# Altium schematic sheet Interface.SchDoc: Relay Tester
size A4 portrait; Date: 2018.12.12; Author: Ivan Perehiniak; Address2: Ivan Perehiniak; Address3: iv.perehinik@gmail.com; Revision: 3; SheetNumber: 3; SheetTotal: 6
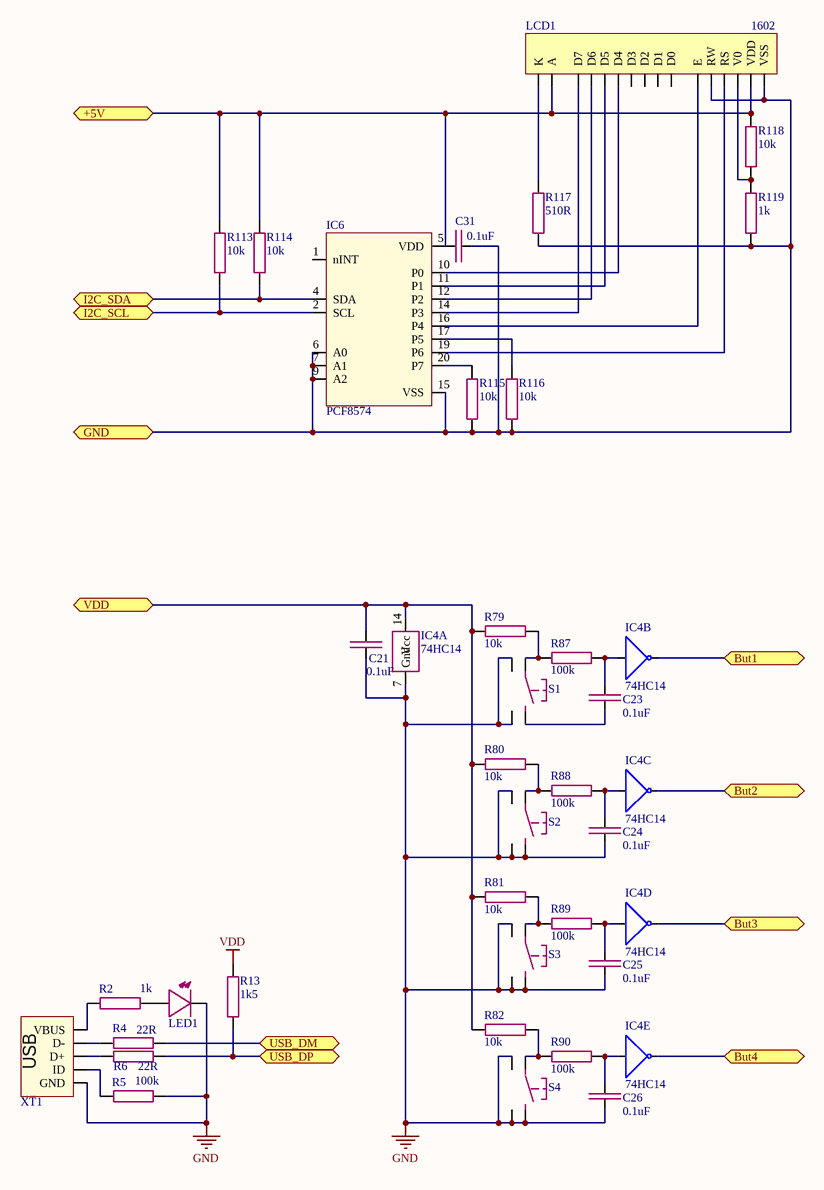
[diagram p0: Interface.SchDoc]

## Parts
C21  0.1uF  [C0603]
C23  0.1uF  [C0603]
C24  0.1uF  [C0603]
C25  0.1uF  [C0603]
C26  0.1uF  [C0603]
C31  0.1uF  [C0603]
IC4  74HC14  [SSOP14]  (parts A,B,C,D,E of 7)
IC6  PCF8574  [SSOP-20N]
LCD1  1602  [Display1602]
LED1  Green LED  [LED0805]  (value not drawn)
R2  1k  [R0603]
R4  22R  [R0603]
R5  100k  [R0603]
R6  22R  [R0603]
R13  1k5  [R0603]
R79  10k  [R0603]
R80  10k  [R0603]
R81  10k  [R0603]
R82  10k  [R0603]
R87  100k  [R0603]
R88  100k  [R0603]
R89  100k  [R0603]
R90  100k  [R0603]
R113  10k  [R0603]
R114  10k  [R0603]
R115  10k  [R0603]
R116  10k  [R0603]
R117  510R  [R0603]
R118  10k  [R0603]
R119  1k  [R0603]
S1  1301.9503  [SW_TACT_HOR]  (value not drawn)
S2  1301.9503  [SW_TACT_HOR]  (value not drawn)
S3  1301.9503  [SW_TACT_HOR]  (value not drawn)
S4  1301.9503  [SW_TACT_HOR]  (value not drawn)
XT1  UX60-MB-5ST  [MiniUSB]  (value not drawn)

## Ports
+5V, But1, But2, But3, But4, GND, I2C_SCL, I2C_SDA, USB_DM, USB_DP, VDD

## Nets
GND: C21.1 C24.1 C25.1 C26.1 IC4.7(Gnd) LED1.2(Cathode) R5.2 S1.1 S1.3 S2.1 S2.3 S2.4 S3.1 S3.3 S3.4 S4.1 S4.3 S4.4 XT1.5(GND)
VDD: R13.2
+5V: C31.2 IC6.5(VDD) LCD1.2(VDD) LCD1.15(A) R113.2 R114.2 R118.2 ; port +5V
But1: IC4.2 ; port But1
But2: IC4.4 ; port But2
But3: IC4.6 ; port But3
But4: IC4.8 ; port But4
GND: C31.1 IC6.6(A0) IC6.7(A1) IC6.9(A2) IC6.15(VSS) LCD1.1(VSS) LCD1.5(RW) R115.1 R116.1 R117.2 R119.1 ; port GND  [a separate net that carries the same name]
I2C_SCL: IC6.2(SCL) R113.1 ; port I2C_SCL
I2C_SDA: IC6.4(SDA) R114.1 ; port I2C_SDA
USB_DM: R4.2 ; port USB_DM
USB_DP: R6.2 R13.1 ; port USB_DP
VDD: C21.2 IC4.14(Vcc) R79.2 R80.2 R81.2 R82.2 ; port VDD  [a separate net that carries the same name]
NetC23_1: C23.1 S1.4
NetC23_2: C23.2 IC4.1 R87.2
NetC24_2: C24.2 IC4.3 R88.2
NetC25_2: C25.2 IC4.5 R89.2
NetC26_2: C26.2 IC4.9 R90.2
NetIC6_10: IC6.10(P0) LCD1.11(D4)
NetIC6_11: IC6.11(P1) LCD1.12(D5)
NetIC6_12: IC6.12(P2) LCD1.13(D6)
NetIC6_14: IC6.14(P3) LCD1.14(D7)
NetIC6_16: IC6.16(P4) LCD1.6(E)
NetIC6_17: IC6.17(P5) R116.2
NetIC6_19: IC6.19(P6) LCD1.4(RS)
NetIC6_20: IC6.20(P7) R115.2
NetLCD1_3: LCD1.3(V0) R118.1 R119.2
NetLCD1_16: LCD1.16(K) R117.1
NetLED1_1: LED1.1(Anode) R2.1
NetR2_2: R2.2 XT1.1(VBUS)
NetR4_1: R4.1 XT1.2(D-)
NetR5_1: R5.1 XT1.4(ID)
NetR6_1: R6.1 XT1.3(D+)
NetR79_1: R79.1 R87.1 S1.2
NetR80_1: R80.1 R88.1 S2.2
NetR81_1: R81.1 R89.1 S3.2
NetR82_1: R82.1 R90.1 S4.2

Not connected (* = marked no-connect by the designer): IC6 1(nINT); LCD1 7(D0) 8(D1) 9(D2) 10(D3)

## Notes on the sheet
- Title
- Size:
- Date:
- A4
- Number:
- Time:
- Revision:
- Sheet
- of
- File:
- (in symbol UX60-MB-5ST) USB

## Library data of the parts
C21 C23-C26 C31 = GMK316F475ZG-T: CAP CER 0.1UF 50V X7R 0603; Category: Capacitors; Manufacturer Part Number: GMK316F475ZG-T; Package / Case: 0603 (1608 Metric); ComponentLink1URL: https://search.kemet.com/component-edge/download/datasheet/C0603C104K5RACTU.pdf; ComponentLink1Description: https://search.kemet.com/component-edge/download/datasheet/C0603C104K5RACTU.pdf
IC4 = MC74HC14ADR2G: IC INVERTER HEX SCHMITT 14SOIC; Category: Integrated Circuits (ICs); Manufacturer Part Number: MC74HC14ADR2G; Package / Case: 14-SOIC (0.154", 3.90mm Width)
IC6 = PCF8574APWR: IC I/O EXPANDER I2C 8B 20TSSOP; Package / Case: 20-TSSOP (0.173", 4.40mm Width); Manufacturer Part Number: PCF8574APWR; Category: Integrated Circuits (ICs)
LCD1 = Display1602: DISP 1602 THT
LED1 = LG R971-KN-1: LED GREEN DIFFUSED 0805 SMD; Category: Optoelectronics; Manufacturer Part Number: LG R971-KN-1; Package / Case: 0805 (2012 Metric)
R2 R119 = ERJ-3GEYJ102V: RES SMD 1K OHM 5% 1/10W 0603; Category: Resistors; Package / Case: 0603 (1608 Metric); Manufacturer Part Number: ERJ-3GEYJ102V; ComponentLink1URL: https://industrial.panasonic.com/cdbs/www-data/pdf/RDA0000/AOA0000C304.pdf; ComponentLink1Description: https://industrial.panasonic.com/cdbs/www-data/pdf/RDA0000/AOA0000C304.pdf; ComponentLink2URL: http://industrial.panasonic.com/www-cgi/jvcr13pz.cgi?E+PZ+3+AOA0005+ERJS03J101V+7+WW; ComponentLink2Description: http://industrial.panasonic.com/www-cgi/jvcr13pz.cgi?E+PZ+3+AOA0005+ERJS03J101V+7+WW; ComponentLink3URL: https://industrial.panasonic.com/cdbs/www-data/pdf/RDO0000/AOA0000C331.pdf; ComponentLink3Description: https://industrial.panasonic.com/cdbs/www-data/pdf/RDO0000/AOA0000C331.pdf
R4 R6 = CRCW060322R0FKEA: RES SMD 22 OHM 1% 1/10W 0603; Category: Resistors; Package / Case: 0603 (1608 Metric); Manufacturer Part Number: CRCW060322R0FKEA
R5 R87-R90 = ERJ-S03J104V: RES SMD 100K OHM 5% 1/10W 0603; Category: Resistors; Package / Case: 0603 (1608 Metric); Manufacturer Part Number: ERJ-S03J104V; ComponentLink1URL: https://industrial.panasonic.com/cdbs/www-data/pdf/RDA0000/AOA0000C304.pdf; ComponentLink1Description: https://industrial.panasonic.com/cdbs/www-data/pdf/RDA0000/AOA0000C304.pdf; ComponentLink2URL: http://industrial.panasonic.com/www-cgi/jvcr13pz.cgi?E+PZ+3+AOA0005+ERJS03J101V+7+WW; ComponentLink2Description: http://industrial.panasonic.com/www-cgi/jvcr13pz.cgi?E+PZ+3+AOA0005+ERJS03J101V+7+WW; ComponentLink3URL: https://industrial.panasonic.com/cdbs/www-data/pdf/RDO0000/AOA0000C331.pdf; ComponentLink3Description: https://industrial.panasonic.com/cdbs/www-data/pdf/RDO0000/AOA0000C331.pdf
R13 = CRCW06031K50JNTABC: RES SMD 1K5 OHM 5% 1/10W 0603; Category: Resistors; Package / Case: 0603 (1608 Metric); Manufacturer Part Number: CRCW06031K50JNTABC
R79-R82 R113-R116 = ERJ-S03J103V: RES SMD 10K OHM 5% 1/10W 0603; Category: Resistors; Package / Case: 0603 (1608 Metric); Manufacturer Part Number: ERJ-S03J103V; ComponentLink1URL: https://industrial.panasonic.com/cdbs/www-data/pdf/RDA0000/AOA0000C304.pdf; ComponentLink1Description: https://industrial.panasonic.com/cdbs/www-data/pdf/RDA0000/AOA0000C304.pdf; ComponentLink2URL: http://industrial.panasonic.com/www-cgi/jvcr13pz.cgi?E+PZ+3+AOA0005+ERJS03J101V+7+WW; ComponentLink2Description: http://industrial.panasonic.com/www-cgi/jvcr13pz.cgi?E+PZ+3+AOA0005+ERJS03J101V+7+WW; ComponentLink3URL: https://industrial.panasonic.com/cdbs/www-data/pdf/RDO0000/AOA0000C331.pdf; ComponentLink3Description: https://industrial.panasonic.com/cdbs/www-data/pdf/RDO0000/AOA0000C331.pdf
R117 = ERJ-3GEYJ511V: RES SMD 510 OHM 5% 1/10W 0603; Category: Resistors; Package / Case: 0603 (1608 Metric); Manufacturer Part Number: ERJ-3GEYJ511V
R118 = CRCW060310K0FKTABC: RES SMD 10K OHM 1% 1/10W 0603; Category: Resistors; Package / Case: 0603 (1608 Metric); Manufacturer Part Number: CRCW060310K0FKTABC
S1-S4 = 1301.9503: SWITCH TACTILE HOR SPST-NO 0.05A 12V; Category: Switches; Manufacturer Part Number: 1301.9503
XT1 = UX60-MB-5ST: CONN RECEPT MINI USB2.0 5POS; Category: Connectors, Interconnects; Manufacturer Part Number: UX60-MB-5ST